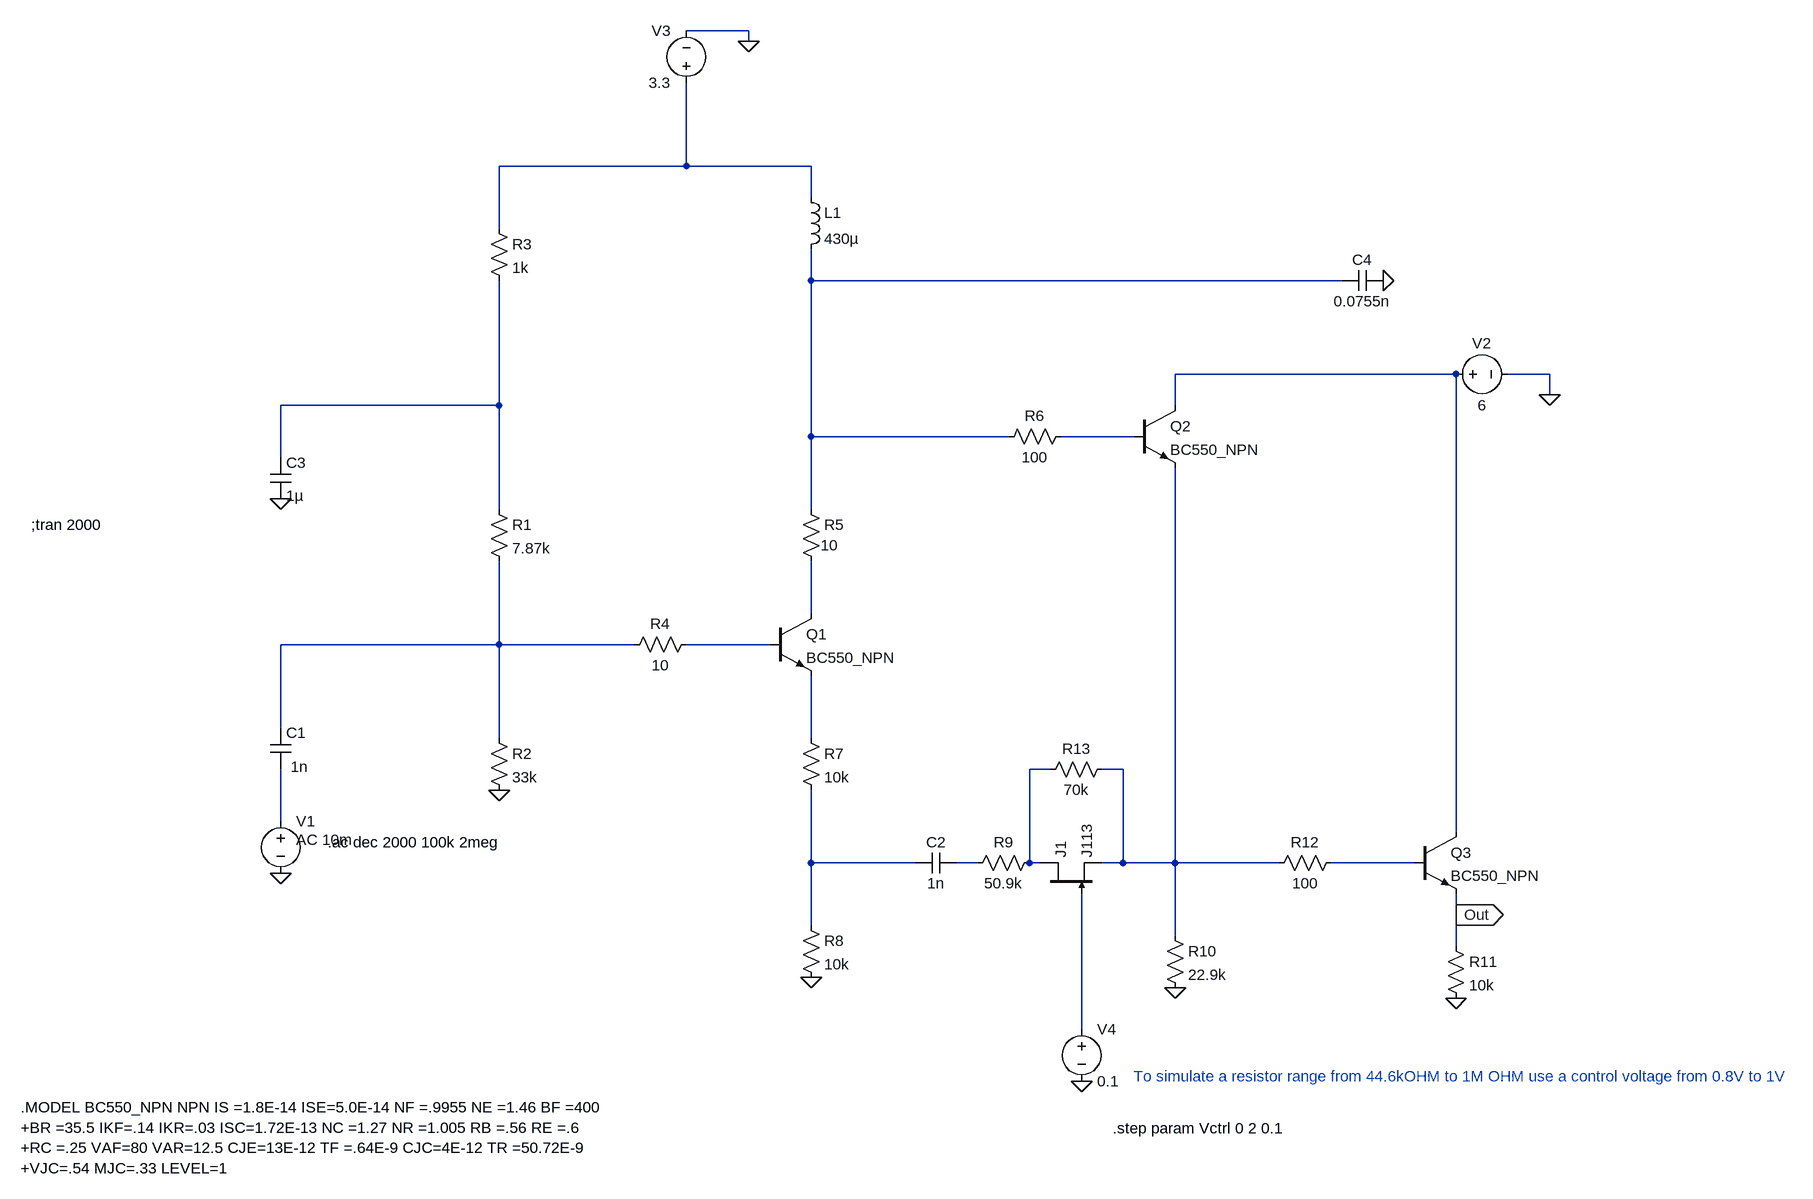
[diagram p0: schematic Tracking_filter_final.asc]
Tracking_filter_final.asc, the LTspice schematic file:
Version 4
SHEET 1 2772 968
WIRE 1088 -1072 992 -1072
WIRE 1088 -1056 1088 -1072
WIRE 992 -864 992 -992
WIRE 992 -864 704 -864
WIRE 1184 -864 992 -864
WIRE 1184 -816 1184 -864
WIRE 704 -768 704 -864
WIRE 1184 -688 1184 -736
WIRE 2000 -688 1184 -688
WIRE 2176 -544 1744 -544
WIRE 2320 -544 2256 -544
WIRE 2320 -512 2320 -544
WIRE 704 -496 704 -688
WIRE 704 -496 368 -496
WIRE 1744 -496 1744 -544
WIRE 1184 -448 1184 -688
WIRE 1488 -448 1184 -448
WIRE 1680 -448 1568 -448
WIRE 368 -416 368 -496
WIRE 704 -336 704 -496
WIRE 1184 -336 1184 -448
WIRE 1184 -176 1184 -256
WIRE 704 -128 704 -256
WIRE 704 -128 368 -128
WIRE 912 -128 704 -128
WIRE 1120 -128 992 -128
WIRE 368 0 368 -128
WIRE 704 16 704 -128
WIRE 1184 16 1184 -80
WIRE 1552 64 1520 64
WIRE 1664 64 1632 64
WIRE 368 144 368 64
WIRE 2176 160 2176 -544
WIRE 1184 208 1184 96
WIRE 1344 208 1184 208
WIRE 1440 208 1408 208
WIRE 1520 208 1520 64
WIRE 1536 208 1520 208
WIRE 1664 208 1664 64
WIRE 1664 208 1632 208
WIRE 1744 208 1744 -400
WIRE 1744 208 1664 208
WIRE 1904 208 1744 208
WIRE 2112 208 1984 208
WIRE 2176 288 2176 256
WIRE 1184 304 1184 208
WIRE 1744 320 1744 208
WIRE 2176 336 2176 288
WIRE 1600 464 1600 256
FLAG 368 224 0
FLAG 368 -352 0
FLAG 704 96 0
FLAG 1184 384 0
FLAG 1744 400 0
FLAG 2176 416 0
FLAG 1088 -1056 0
FLAG 2320 -512 0
FLAG 2064 -688 0
FLAG 2176 288 Out
IOPIN 2176 288 Out
FLAG 1600 544 0
SYMBOL npn 1120 -176 R0
SYMATTR InstName Q1
SYMATTR Value BC550_NPN
SYMBOL npn 1680 -496 R0
SYMATTR InstName Q2
SYMATTR Value BC550_NPN
SYMBOL npn 2112 160 R0
SYMATTR InstName Q3
SYMATTR Value BC550_NPN
SYMBOL res 688 -352 R0
SYMATTR InstName R1
SYMATTR Value 7.87k
SYMBOL res 688 0 R0
SYMATTR InstName R2
SYMATTR Value 33k
SYMBOL res 688 -784 R0
SYMATTR InstName R3
SYMATTR Value 1k
SYMBOL res 1008 -144 R90
WINDOW 0 0 56 VBottom 2
WINDOW 3 32 56 VTop 2
SYMATTR InstName R4
SYMATTR Value 10
SYMBOL res 1168 -352 R0
WINDOW 3 31 71 Left 2
SYMATTR Value 10
SYMATTR InstName R5
SYMBOL res 1584 -464 R90
WINDOW 0 0 56 VBottom 2
WINDOW 3 32 56 VTop 2
SYMATTR InstName R6
SYMATTR Value 100
SYMBOL res 1168 0 R0
SYMATTR InstName R7
SYMATTR Value 10k
SYMBOL res 1168 288 R0
SYMATTR InstName R8
SYMATTR Value 10k
SYMBOL res 1728 304 R0
SYMATTR InstName R10
SYMATTR Value 22.9k
SYMBOL res 2160 320 R0
SYMATTR InstName R11
SYMATTR Value 10k
SYMBOL res 2000 192 R90
WINDOW 0 0 56 VBottom 2
WINDOW 3 32 56 VTop 2
SYMATTR InstName R12
SYMATTR Value 100
SYMBOL ind 1168 -832 R0
SYMATTR InstName L1
SYMATTR Value 430µ
SYMBOL cap 352 0 R0
WINDOW 3 31 60 Left 2
SYMATTR Value 1n
SYMATTR InstName C1
SYMBOL cap 1408 192 R90
WINDOW 0 0 32 VBottom 2
WINDOW 3 32 32 VTop 2
SYMATTR InstName C2
SYMATTR Value 1n
SYMBOL cap 352 -416 R0
WINDOW 3 24 59 Left 2
SYMATTR Value 1µ
SYMATTR InstName C3
SYMBOL cap 2064 -704 R90
WINDOW 0 0 32 VBottom 2
WINDOW 3 32 32 VTop 2
SYMATTR InstName C4
SYMATTR Value 0.0755n
SYMBOL voltage 368 128 R0
WINDOW 123 24 44 Left 2
WINDOW 39 0 0 Left 0
SYMATTR Value2 AC 10m
SYMATTR InstName V1
SYMATTR Value ""
SYMBOL voltage 2160 -544 R270
WINDOW 0 32 56 VTop 2
WINDOW 3 -32 56 VBottom 2
WINDOW 123 0 0 Left 0
WINDOW 39 0 0 Left 0
SYMATTR InstName V2
SYMATTR Value 6
SYMBOL voltage 992 -976 R180
WINDOW 0 24 96 Left 2
WINDOW 3 24 16 Left 2
WINDOW 123 0 0 Left 0
WINDOW 39 0 0 Left 0
SYMATTR InstName V3
SYMATTR Value 3.3
SYMBOL njf 1536 256 R270
SYMATTR InstName J1
SYMATTR Value J113
SYMBOL voltage 1600 448 R0
WINDOW 123 0 0 Left 0
WINDOW 39 0 0 Left 0
SYMATTR InstName V4
SYMATTR Value 0.1
SYMBOL res 1536 192 R90
WINDOW 0 0 56 VBottom 2
WINDOW 3 32 56 VTop 2
SYMATTR InstName R9
SYMATTR Value 50.9k
SYMBOL res 1648 48 R90
WINDOW 0 0 56 VBottom 2
WINDOW 3 32 56 VTop 2
SYMATTR InstName R13
SYMATTR Value 70k
TEXT -32 584 Left 2 !.MODEL BC550_NPN NPN IS =1.8E-14 ISE=5.0E-14 NF =.9955 NE =1.46 BF =400\n+BR =35.5 IKF=.14 IKR=.03 ISC=1.72E-13 NC =1.27 NR =1.005 RB =.56 RE =.6\n+RC =.25 VAF=80 VAR=12.5 CJE=13E-12 TF =.64E-9 CJC=4E-12 TR =50.72E-9\n+VJC=.54 MJC=.33 LEVEL=1
TEXT 440 176 Left 2 !.ac dec 2000 100k 2meg
TEXT -16 -312 Left 2 !;tran 2000
TEXT 1680 536 Left 2 ;To simulate a resistor range from 44.6kOHM to 1M OHM use a control voltage from 0.8V to 1V
TEXT 1648 616 Left 2 !.step param Vctrl 0 2 0.1

The netlist it stands for:
* Tracking_filter_final.asc
Q1 N006 N008 N009 0 BC550_NPN
Q2 N003 N005 N011 0 BC550_NPN
Q3 N003 N015 Out 0 BC550_NPN
R1 N004 N007 7.87k
R2 N007 0 33k
R3 N001 N004 1k
R4 N008 N007 10
R5 N002 N006 10
R6 N005 N002 100
R7 N009 N013 10k
R8 N013 0 10k
R10 N011 0 22.9k
R11 Out 0 10k
R12 N015 N011 100
L1 N001 N002 430µ
C1 N007 N012 1n
C2 N014 N013 1n
C3 N004 0 1µ
C4 0 N002 0.0755n
V1 N012 0 AC 10m
V2 N003 0 6
V3 N001 0 3.3
J1 N010 N016 N011 J113
V4 N016 0 0.1
R9 N010 N014 50.9k
R13 N011 N010 70k
.model NPN NPN
.model PNP PNP
.lib standard.bjt
.model NJF NJF
.model PJF PJF
.lib standard.jft
.MODEL BC550_NPN NPN IS =1.8E-14 ISE=5.0E-14 NF =.9955 NE =1.46 BF =400
+BR =35.5 IKF=.14 IKR=.03 ISC=1.72E-13 NC =1.27 NR =1.005 RB =.56 RE =.6
+RC =.25 VAF=80 VAR=12.5 CJE=13E-12 TF =.64E-9 CJC=4E-12 TR =50.72E-9
+VJC=.54 MJC=.33 LEVEL=1
.ac dec 2000 100k 2meg
;tran 2000
* To simulate a resistor range from 44.6kOHM to 1M OHM use a control voltage from 0.8V to 1V
.step param Vctrl 0 2 0.1
.backanno
.end